# EAGLE design Sonar Amp (EAGLE 5.12)
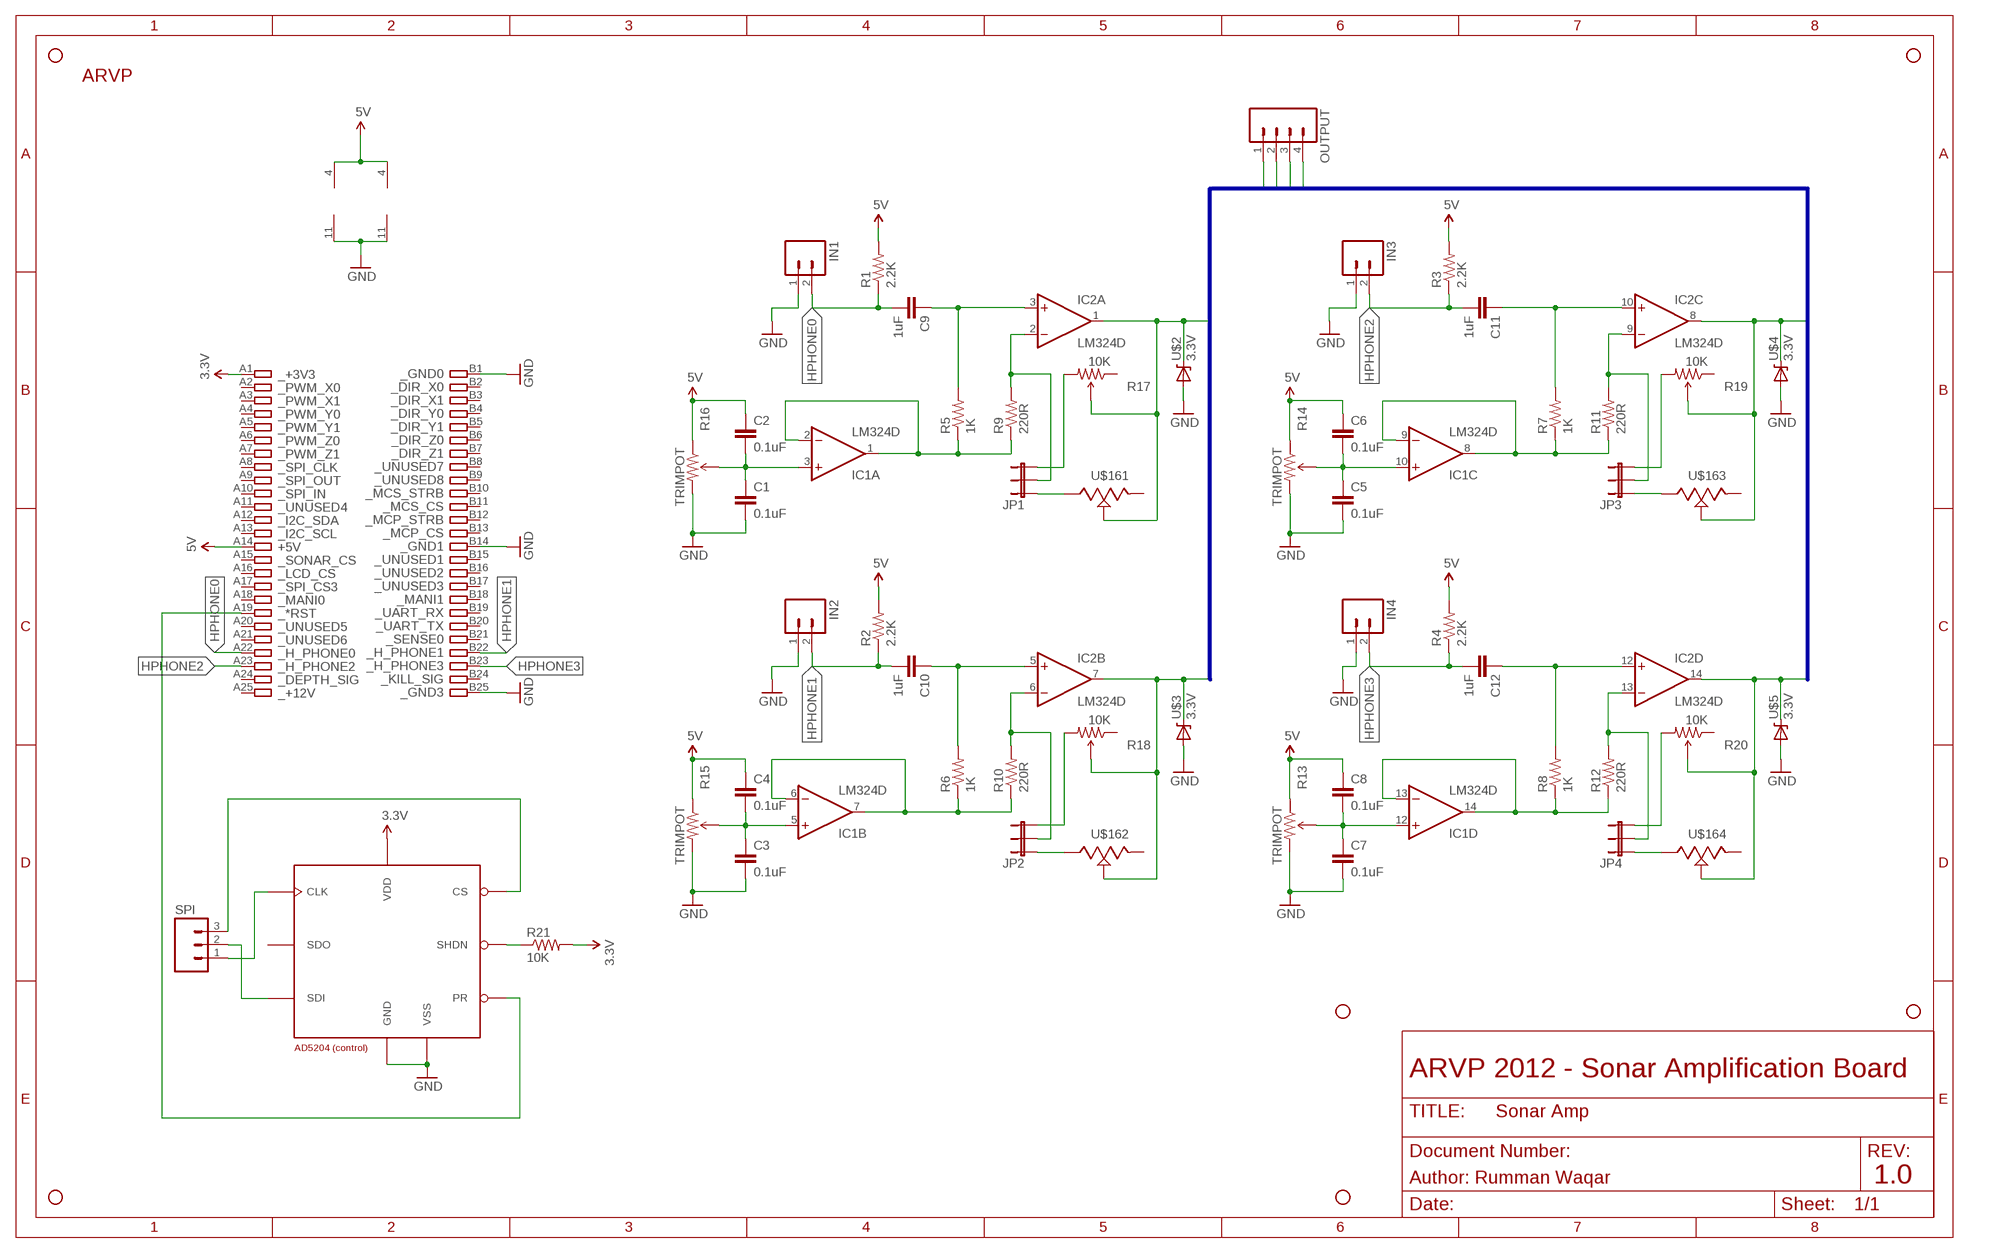
[diagram p0: schematic, sheet 1]

## Parts
C1  0.1uF  CAP1206  [1206]
C2  0.1uF  CAP1206  [1206]
C3  0.1uF  CAP1206  [1206]
C4  0.1uF  CAP1206  [1206]
C5  0.1uF  CAP1206  [1206]
C6  0.1uF  CAP1206  [1206]
C7  0.1uF  CAP1206  [1206]
C8  0.1uF  CAP1206  [1206]
C9  1uF  CAP1210  [1210]
C10  1uF  CAP1210  [1210]
C11  1uF  CAP1210  [1210]
C12  1uF  CAP1210  [1210]
IC1  LM324D  [SO14]
IC2  LM324D  [SO14]
IN1  M02POLAR_LOCK  [MOLEX-1X2_LOCK]
IN2  M02POLAR_LOCK  [MOLEX-1X2_LOCK]
IN3  M02POLAR_LOCK  [MOLEX-1X2_LOCK]
IN4  M02POLAR_LOCK  [MOLEX-1X2_LOCK]
JP1  JUMPER-3PTH  [1X03]
JP2  JUMPER-3PTH  [1X03]
JP3  JUMPER-3PTH  [1X03]
JP4  JUMPER-3PTH  [1X03]
JP5  STAND-OFF  [STAND-OFF]
JP6  STAND-OFF  [STAND-OFF]
JP7  STAND-OFF  [STAND-OFF]
JP8  STAND-OFF  [STAND-OFF]
JP9  STAND-OFF  [STAND-OFF]
JP10  STAND-OFF  [STAND-OFF]
OUTPUT  M04POLAR  [MOLEX-1X4]
R1  2.2K  RESISTOR1206  [1206]
R2  2.2K  RESISTOR1206  [1206]
R3  2.2K  RESISTOR1206  [1206]
R4  2.2K  RESISTOR1206  [1206]
R5  1K  RESISTOR1206  [1206]
R6  1K  RESISTOR1206  [1206]
R7  1K  RESISTOR1206  [1206]
R8  1K  RESISTOR1206  [1206]
R9  220R  RESISTOR1206  [1206]
R10  220R  RESISTOR1206  [1206]
R11  220R  RESISTOR1206  [1206]
R12  220R  RESISTOR1206  [1206]
R13  TRIMPOT  [3362U-2]
R14  TRIMPOT  [3362U-2]
R15  TRIMPOT  [3362U-2]
R16  TRIMPOT  [3362U-2]
R17  10K  TRIMPOT  [3362U-2]
R18  10K  TRIMPOT  [3362U-2]
R19  10K  TRIMPOT  [3362U-2]
R20  10K  TRIMPOT  [3362U-2]
R21  10K  RESISTOR1206  [1206]
SPI  M03POLAR  [MOLEX-1X3]
U$1  CARD_50PIN  [CARD_50PIN]
U$2  3.3V  DIODE-ZENERPTH  [DIODE-ZENER]
U$3  3.3V  DIODE-ZENERPTH  [DIODE-ZENER]
U$4  3.3V  DIODE-ZENERPTH  [DIODE-ZENER]
U$5  3.3V  DIODE-ZENERPTH  [DIODE-ZENER]
U$16  AD5204R  [SOL-24]
U$17  ARVP_LOGO  [ARVP]

## Nets
3.3V: R21.2 U$1.A1 U$16.VDD(CONTROL:VDD)
5V: C2.1 C4.1 C6.1 C8.1 IC1.4(P:V+) IC2.4(P:V+) R1.2 R2.2 R3.2 R4.2 R13.1(CCW) R14.1(CCW) R15.1(CCW) R16.1(CCW) U$1.A14
GND: C1.2 C3.2 C5.2 C7.2 IC1.11(P:V-) IC2.11(P:V-) IN1.1 IN2.1 IN3.1 IN4.1 R13.3(CW) R14.3(CW) R15.3(CW) R16.3(CW) U$1.B1 U$1.B14 U$1.B25 U$2.P$2(A) U$3.P$2(A) U$4.P$2(A) U$5.P$2(A) U$16.GND(CONTROL:GND) U$16.VSS(CONTROL:VSS)
HPHONE0: C9.2 IN1.2 R1.1 U$1.A22
HPHONE1: C10.2 IN2.2 R2.1 U$1.B22
HPHONE2: C11.2 IN3.2 R3.1 U$1.A23
HPHONE3: C12.2 IN4.2 R4.1 U$1.B23
N$1: C1.1 C2.2 IC1.3(A:+IN) R16.2(WIPER)
N$2: IC1.6(B:-IN) IC1.7(B:OUT) R6.1 R10.1
N$3: IC1.1(A:OUT) IC1.2(A:-IN) R5.1 R9.1
N$4: JP1.3 R17.3(CW)
N$5: C9.1 IC2.3(A:+IN) R5.2
N$6: IC2.2(A:-IN) JP1.2 R9.2
N$7: SPI.2 U$16.SDI(CONTROL:SDI)
N$8: JP1.1 U$16.A1(1:A)
N$9: C3.1 C4.2 IC1.5(B:+IN) R15.2(WIPER)
N$10: C10.1 IC2.5(B:+IN) R6.2
N$11: JP2.1 U$16.A2(2:A)
N$12: C5.1 C6.2 IC1.10(C:+IN) R14.2(WIPER)
N$13: IC2.6(B:-IN) JP2.2 R10.2
N$15: C7.1 C8.2 IC1.12(D:+IN) R13.2(WIPER)
N$16: JP2.3 R18.3(CW)
N$17: IC1.8(C:OUT) IC1.9(C:-IN) R7.1 R11.1
N$18: JP3.1 U$16.A3(3:A)
N$19: IC1.13(D:-IN) IC1.14(D:OUT) R8.1 R12.1
N$20: C11.1 IC2.10(C:+IN) R7.2
N$21: IC2.9(C:-IN) JP3.2 R11.2
N$23: JP3.3 R19.3(CW)
N$24: C12.1 IC2.12(D:+IN) R8.2
N$25: JP4.1 U$16.A4(4:A)
N$26: IC2.13(D:-IN) JP4.2 R12.2
N$28: JP4.3 R20.3(CW)
N$30: U$1.A19 U$16.PR(CONTROL:PR)
N$31: SPI.1 U$16.CLK(CONTROL:CLK)
N$32: SPI.3 U$16.CS(CONTROL:CS)
N$33: R21.1 U$16.SHDN(CONTROL:SHDN)
OUT1: IC2.1(A:OUT) OUTPUT.1 R17.2(WIPER) U$2.P$1(C) U$16.W1(1:W)
OUT2: IC2.7(B:OUT) OUTPUT.2 R18.2(WIPER) U$3.P$1(C) U$16.W2(2:W)
OUT3: IC2.8(C:OUT) OUTPUT.3 R19.2(WIPER) U$4.P$1(C) U$16.W3(3:W)
OUT4: IC2.14(D:OUT) OUTPUT.4 R20.2(WIPER) U$5.P$1(C) U$16.W4(4:W)
Unconnected: R17.1(CCW) R18.1(CCW) R19.1(CCW) R20.1(CCW) U$1.A2 U$1.A3 U$1.A4 U$1.A5 U$1.A6 U$1.A7 U$1.A8 U$1.A9 U$1.A10 U$1.A11 U$1.A12 U$1.A13 U$1.A15 U$1.A16 U$1.A17 U$1.A18 U$1.A20 U$1.A21 U$1.A24 U$1.A25 U$1.B2 U$1.B3 U$1.B4 U$1.B5 U$1.B6 U$1.B7 U$1.B8 U$1.B9 U$1.B10 U$1.B11 U$1.B12 U$1.B13 U$1.B15 U$1.B16 U$1.B17 U$1.B18 U$1.B19 U$1.B20 U$1.B21 U$1.B24 U$16.B1(1:B) U$16.B2(2:B) U$16.B3(3:B) U$16.B4(4:B) U$16.SDO(CONTROL:SDO)

## Buses
OUT1,OUT2,OUT3,OUT4

## Notes on the sheet
- ARVP 2012 - Sonar Amplification Board
- Author: Rumman Waqar | 1.0

## Library data of the parts
C1-C12 = SparkFun:CAP: Capacitor Standard 0603 ceramic capacitor, and 0.1" leaded capacitor.
IC1 IC2 = linear:LM324: OP AMP
IN1-IN4 = SparkFun:M02: Header 2 Standard 2-pin 0.1" header. Use with straight break away headers (SKU : PRT-00116), right angle break away headers (PRT-00553), swiss pins (PRT-00743), machine pins (PRT-00117), and female headers (PRT-00115). Molex polarized connector foot print use with SKU : PRT-08233 with associated crimp pins and housings.
JP1-JP4 = SparkFun:JUMPER-3
JP5-JP10 = SparkFun:STAND-OFF: Stand Off This is the mechanical footprint for a #4 phillips button head screw. Use the keepout ring to avoid running the screw head into surrounding components. SKU : PRT-00447
OUTPUT = SparkFun:M04: Header 4 Standard 4-pin 0.1" header. Use with straight break away headers (SKU : PRT-00116), right angle break away headers (PRT-00553), swiss pins (PRT-00743), machine pins (PRT-00117), and female headers (PRT-00115). Molex polarized connector foot print use with SKU : PRT-08231 with associated crimp pins and housings. 1MM SMD Version SKU: PRT-10208
R1-R12 R21 = SparkFun:RESISTOR: Resistor Basic schematic elements and footprints for 0603, 1206, and PTH resistors.
R13-R20 = SparkFun:TRIMPOT
SPI = SparkFun:M03: Header 3 Standard 3-pin 0.1" header. Use with straight break away headers (SKU : PRT-00116), right angle break away headers (PRT-00553), swiss pins (PRT-00743), machine pins (PRT-00117), and female headers (PRT-00115). Molex polarized connector foot print use with SKU : PRT-08232 with associated crimp pins and housings.
U$1 = ARVP:CARD_50PIN
U$2-U$5 = SparkFun:DIODE-ZENER: Zener Diode Production Part - 8199 3.4V Zener Voltage
U$16 = AD5204:AD5204: AD5204 - 4-Channel Digital Potentiometer
U$17 = ARVP:ARVP_LOGO

## Board
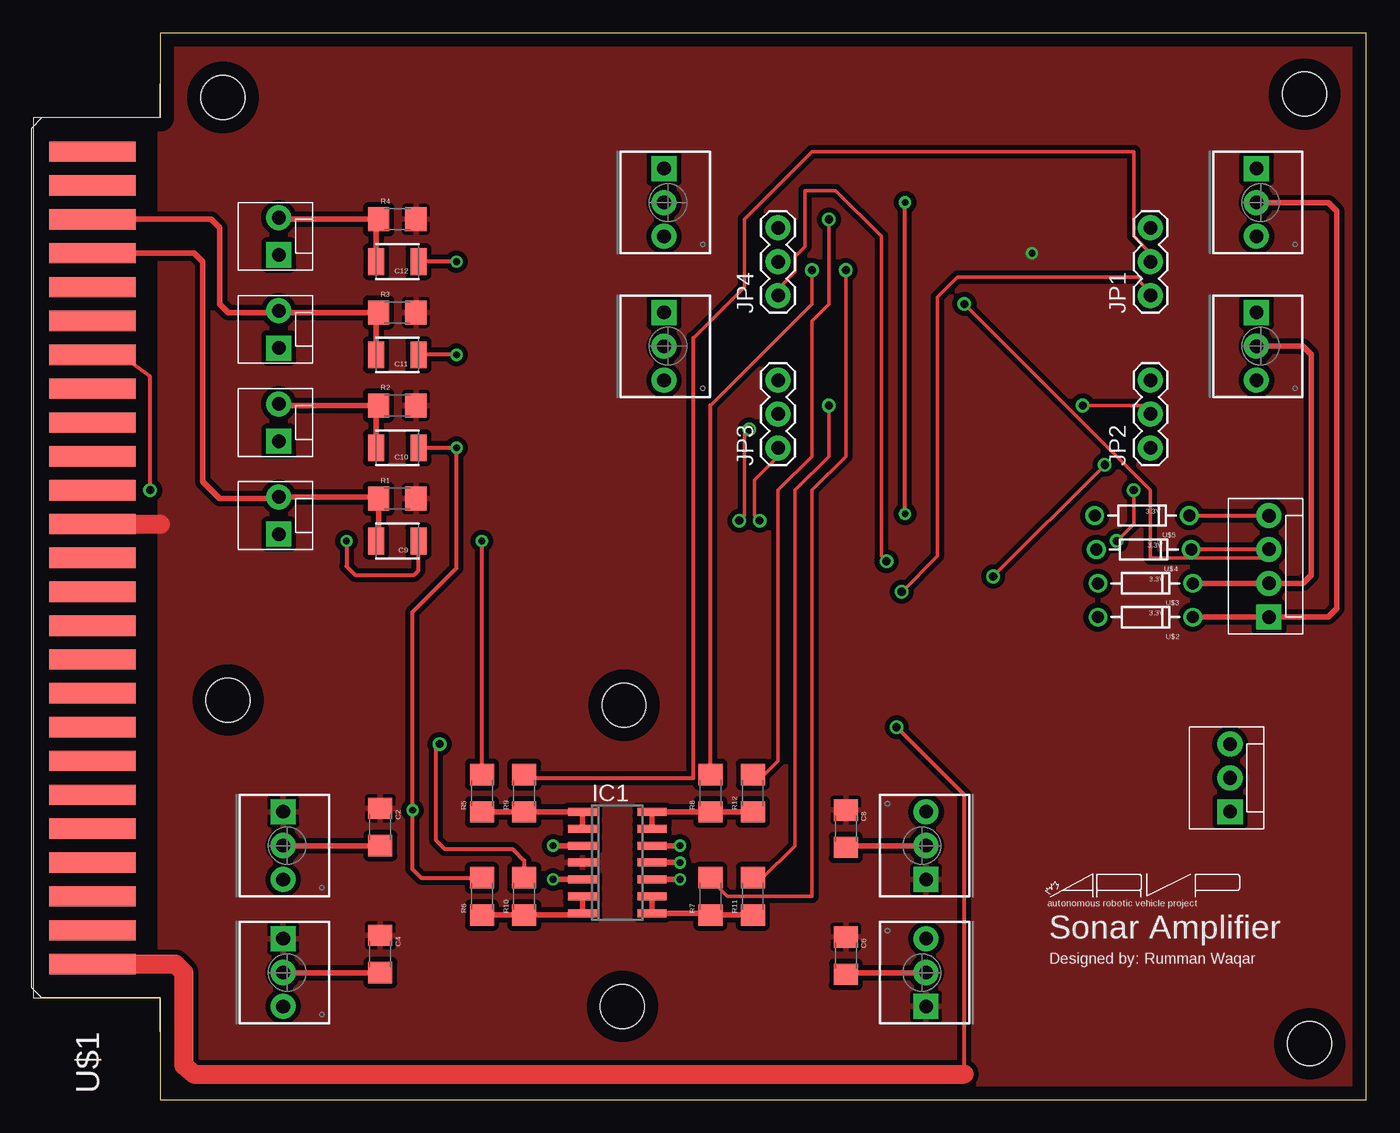
[diagram p1: board, top side]
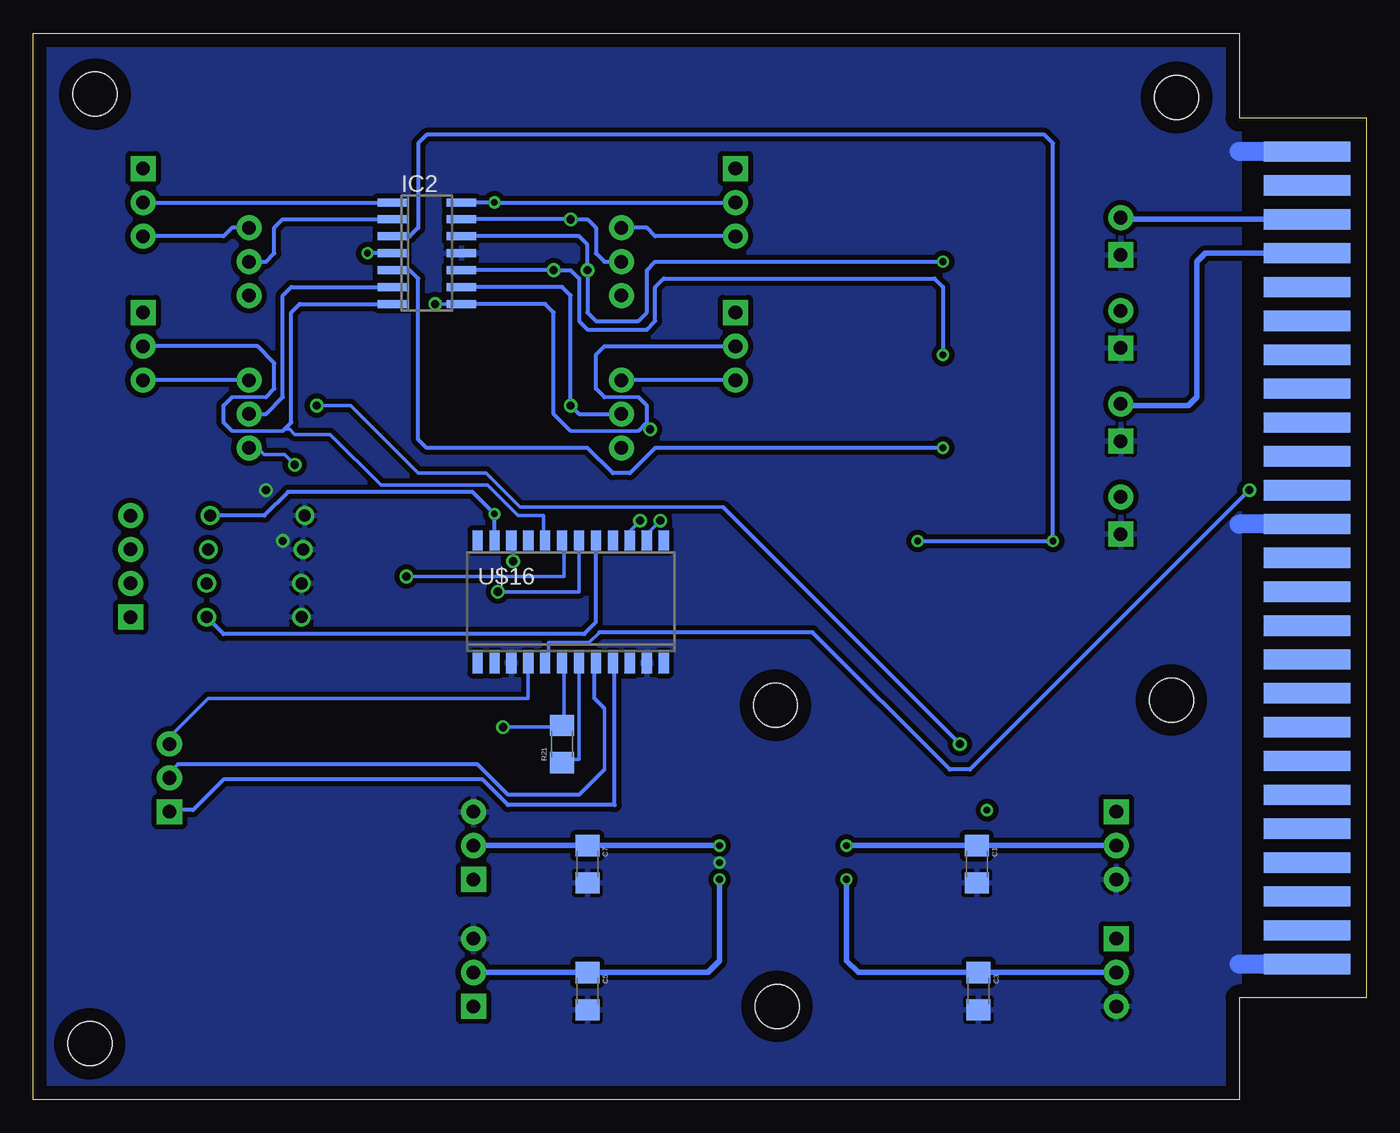
[diagram p2: board, bottom side, seen from below]

Size 100 x 80 mm. Coordinates in mm from the lower left corner, seen from the top.
Outline: 100,0 100,80 9.53,80 9.53,73.66 0,73.66 0,7.62 9.53,7.62 9.53,0 100,0
Copper layers (1*16): Top 0.035mm / dielectric 1.5mm / Bottom 0.035mm
Design rules "default": minimum track width 10mil, minimum drill 24mil, track to track 8mil, track to pad 8mil, pad to pad 8mil, via to via 8mil, smd to smd 8mil, copper to edge 40mil, drill to drill 8mil, minimum pad ring 10mil, minimum via ring 8mil, stop-mask expansion 4mil, vias tented up to drill 0mil, thermal gap 10mil

### Footprints (pad centres in the part's own frame; a part is rotated, then mirrored left to right if it is on the bottom)
1206 = smd 1.6 x 1.8: 1 -1.4,0; 2 1.4,0
1210 = smd 1.2 x 2: 1 -1.6,0; 2 1.6,0
SO14 = smd 0.6 x 2.2: 1 -3.81,-2.6; 2 -2.54,-2.6; 3 -1.27,-2.6; 4 0,-2.6; 5 1.27,-2.6; 6 2.54,-2.6; 7 3.81,-2.6; 8 3.81,2.6; 9 2.54,2.6; 10 1.27,2.6; 11 0,2.6; 12 -1.27,2.6; 13 -2.54,2.6; 14 -3.81,2.6
MOLEX-1X2_LOCK = drill 1.016 pad 1.88 square: 1 -0.127,0 | drill 1.016 pad 1.88 round: 2 2.667,0
1X03 = drill 1.016 pad 1.88 round: 1 0,0; 2 2.54,0; 3 5.08,0
STAND-OFF = hole 3.302: 0,0
MOLEX-1X4 = drill 1.016 pad 1.88 square: 1 0,0 | drill 1.016 pad 1.88 round: 2 2.54,0; 3 5.08,0; 4 7.62,0
3362U-2 = drill 1.016 pad 1.88 square: 1 -2.54,-0.305 | drill 1.016 pad 1.88 round: 2 0,-0.305; 3 2.54,-0.305
MOLEX-1X3 = drill 1.016 pad 1.88 square: 1 0,0 | drill 1.016 pad 1.88 round: 2 2.54,0; 3 5.08,0
CARD_50PIN = smd 1.524 x 6.477: A1 63.5,3.81; A2 60.96,3.81; A3 58.42,3.81; A4 55.88,3.81; A5 53.34,3.81; A6 50.8,3.81; A7 48.26,3.81; A8 45.72,3.81; A9 43.18,3.81; A10 40.64,3.81; A11 38.1,3.81; A12 35.56,3.81; A13 33.02,3.81; A14 30.48,3.81; A15 27.94,3.81; A16 25.4,3.81; A17 22.86,3.81; A18 20.32,3.81; A19 17.78,3.81; A20 15.24,3.81; A21 12.7,3.81; A22 10.16,3.81; A23 7.62,3.81; A24 5.08,3.81; A25 2.54,3.81 | smd 1.524 x 6.477 bottom: B1 63.5,3.81; B2 60.96,3.81; B3 58.42,3.81; B4 55.88,3.81; B5 53.34,3.81; B6 50.8,3.81; B7 48.26,3.81; B8 45.72,3.81; B9 43.18,3.81; B10 40.64,3.81; B11 38.1,3.81; B12 35.56,3.81; B13 33.02,3.81; B14 30.48,3.81; B15 27.94,3.81; B16 25.4,3.81; B17 22.86,3.81; B18 20.32,3.81; B19 17.78,3.81; B20 15.24,3.81; B21 12.7,3.81; B22 10.16,3.81; B23 7.62,3.81; B24 5.08,3.81; B25 2.54,3.81
DIODE-ZENER = drill 0.9 round: P$1 -3.556,0; P$2 3.556,0
SOL-24 = smd 0.762 x 1.524: A1 0.635,4.6; A2 -0.635,4.6; A3 4.445,4.6; A4 -4.445,4.6; B1 3.175,4.6; B2 -3.175,4.6; B3 6.985,4.6; B4 -6.985,4.6; CLK 3.175,-4.6; CS -3.175,-4.6; GND -4.445,-4.6; NC -6.985,-4.6; NC2 -5.715,-4.6; NC3 6.985,-4.6; PR -1.905,-4.6; SDI 1.905,-4.6; SDO 4.445,-4.6; SHDN 0.635,-4.6; VDD -0.635,-4.6; VSS 5.715,-4.6; W1 1.905,4.6; W2 -1.905,4.6; W3 5.715,4.6; W4 -5.715,4.6

### Placement (x,y rotation side)
C1  29.21,17.65 270 bottom
C2  26.04,20.45 270 top
C3  29.08,8.13 270 bottom
C4  26.04,10.92 270 top
C5  58.42,8.13 270 bottom
C6  60.96,10.79 270 top
C7  58.42,17.65 270 bottom
C8  60.96,20.32 270 top
C9  27.3,41.91 180 top
C10  27.3,48.9 180 top
C11  27.3,55.88 180 top
C12  27.3,62.87 180 top
IC1  43.81,17.78 270 top
IC2  70.48,63.5 270 bottom
IN1  18.41,42.55 90 top
IN2  18.41,49.53 90 top
IN3  18.41,56.52 90 top
IN4  18.41,63.5 90 top
JP1  83.82,60.33 90 top
JP2  83.82,48.9 90 top
JP3  55.88,48.9 90 top
JP4  55.88,60.33 90 top
JP5  95.76,4.19 0 top
JP6  95.38,75.44 0 top
JP7  44.2,6.99 0 top
JP8  14.61,29.97 0 top
JP9  14.22,75.18 0 top
JP10  44.32,29.59 0 top
OUTPUT  92.71,36.2 90 top
R1  27.3,45.09 0 top
R2  27.3,52.07 0 top
R3  27.3,59.05 0 top
R4  27.3,66.04 0 top
R5  33.66,22.99 90 top
R6  33.66,15.24 90 top
R7  50.8,15.24 90 top
R8  50.8,22.99 90 top
R9  36.83,22.99 90 top
R10  36.83,15.24 90 top
R11  53.98,15.24 90 top
R12  53.98,22.99 90 top
R13  66.67,19.05 90 top
R14  66.67,9.53 90 top
R15  19.05,9.53 270 top
R16  19.05,19.05 270 top
R17  92.08,67.31 270 top
R18  92.08,56.52 270 top
R19  47.62,56.52 270 top
R20  47.62,67.31 270 top
R21  60.33,26.67 90 bottom
SPI  89.79,21.59 90 top
U$1  0.64,73.66 270 top
U$2  83.44,36.2 180 top
U$3  83.44,38.73 180 top
U$4  83.31,41.27 180 top
U$5  83.19,43.81 180 top
U$16  59.69,37.34 0 bottom
U$17  76.07,14.48 0 top

### Tracks (layer width: path | path; a pad name or v marks a point on that pad's centre or on a via)
3.3V  (via drill 0.61)
  Top 0.305: v64.77,27.94 69.85,22.86 69.85,1.91
  Top 1.422: U$1.A1 10.67,10.16 11.3,9.53 11.3,2.54 12.06,1.91 69.85,1.91
  Bottom 0.254: v64.77,27.94 60.96,27.94 R21.2 60.2,28.19 60.2,32.38 U$16.VDD
5V  (via drill 0.51)
  Top 1.422: U$1.A14 9.53,43.18
  Bottom 0.305: IC2.4 v74.93,63.5
  pour Top (isolate 0.381): 9.53,80.01 100.33,80.01 100.33,0 9.53,0
GND  (via drill 0.51, 0.61)
  Top 0.254: v81.28,41.91 82.55,43.18 v82.55,45.72
  Top 0.406: IC1.11 v48.51,17.78
  Bottom 1.422: U$1.B1 9.53,10.16 | U$1.B14 9.53,43.18 | U$1.B25 9.53,71.12
  pour Bottom (isolate 0.381): 9.53,80.01 100.33,80.01 100.33,0 9.53,0
HPHONE0
  Top 0.406: U$1.A22 12.06,63.5 12.7,62.87 12.7,46.35 13.97,45.09 18.29,45.09 IN1.2 25.78,45.21 R1.1 25.91,42.11 C9.2
HPHONE1
  Top 0.406: C10.2 25.7,51.87 R2.1 18.54,52.07 IN2.2
  Bottom 0.406: U$1.B22 12.06,63.5 12.7,62.87 12.7,52.7 13.34,52.07 18.29,52.07 IN2.2
HPHONE2
  Top 0.406: U$1.A23 13.34,66.04 13.97,65.41 13.97,59.69 14.61,59.05 18.29,59.05 IN3.2 18.54,59.05 R3.1 25.7,58.85 C11.2
HPHONE3
  Top 0.406: C12.2 25.7,65.84 R4.1 18.54,66.04 IN4.2
  Bottom 0.406: U$1.B23 18.29,66.04 IN4.2
N$1  (via drill 0.51)
  Top 0.406: C2.2 R16.2 | IC1.3 v38.99,19.05
  Bottom 0.406: R16.2 19,19.05 C1.1 v38.99,19.05
N$2
  Top 0.406: R6.1 R10.1 41.09,13.84 IC1.7 IC1.6
N$3
  Top 0.406: IC1.2 IC1.1 R9.1 R5.1
N$4
  Bottom 0.305: JP1.3 85.09,65.41 85.72,64.77 R17.3
N$5  (via drill 0.51)
  Top 0.305: C9.1 28.91,39.7 28.57,39.37 24.13,39.37 23.5,40.01 v23.5,41.91 | R5.2 v33.66,41.91
  Bottom 0.305: IC2.3 71.75,64.77 71.12,65.41 71.12,71.75 70.48,72.39 24.13,72.39 23.5,71.75 v23.5,41.91 v33.66,41.91
N$6
  Top 0.254: 49.53,57.15 53.34,60.96 53.34,66.04 58.42,71.12 82.55,71.12 82.55,64.77 83.82,63.5 JP1.2 | R9.2 36.83,24.13
  Top 0.305: 36.83,24.13 49.53,24.13 49.53,57.15
  Bottom 0.305: IC2.2 81.28,66.04 81.92,65.41 81.92,63.5 82.55,62.87 JP1.2
N$7
  Bottom 0.254: 57.15,24.77 57.15,29.34 | 89.15,25.15 89.92,24.38 SPI.2 | 57.91,32.38 U$16.SDI
  Bottom 0.305: 57.91,32.38 57.91,30.1 57.15,29.34 | 57.15,24.77 59.05,22.86 64.39,22.86 66.67,25.15 89.15,25.15
N$8  (via drill 0.61)
  Top 0.254: v65.15,38.1 67.82,40.77 67.82,60.2 69.34,61.72 83.06,61.72 83.06,61.34 83.82,60.58 JP1.1
  Bottom 0.254: v65.15,38.1 59.05,38.1 U$16.A1
N$9  (via drill 0.51)
  Top 0.406: C4.2 R15.2 | v38.99,16.51 IC1.5
  Bottom 0.406: R15.2 18.88,9.53 C3.1 38.1,9.53 38.99,10.41 v38.99,16.51
N$10  (via drill 0.51)
  Top 0.305: C10.1 v31.75,48.9 31.75,39.88 28.45,36.58 v28.45,21.72 28.45,17.27 29.08,16.64 R6.2
  Bottom 0.305: IC2.5 71.75,62.23 71.12,61.59 71.12,49.53 70.48,48.9 58.42,48.9 56.52,46.99 55.24,46.99 53.34,48.9 v31.75,48.9
N$11  (via drill 0.61)
  Top 0.254: v72.01,39.24 v80.39,47.62
  Bottom 0.254: v72.01,39.24 60.2,39.24 60.2,41.91 U$16.A2 | v80.39,47.62 81.15,48.39 82.68,48.39 83.06,48.77 83.82,48.77 JP2.1
N$12  (via drill 0.51)
  Top 0.406: R14.2 61.09,9.53 C6.2 | v48.51,16.51 IC1.10
  Bottom 0.406: R14.2 C5.1 49.4,9.53 48.51,10.41 v48.51,16.51
N$13  (via drill 0.61)
  Top 0.254: v78.74,52.07 83.82,52.07 JP2.2 | 30.35,26.67 v30.48,26.67
  Top 0.305: R10.2 36.83,17.91 35.94,18.8 30.86,18.8 30.23,19.43 30.23,26.54 30.35,26.67
  Bottom 0.254: 48.26,44.45 63.5,44.45 66.04,46.99 71.12,46.99 76.2,52.07 v78.74,52.07
  Bottom 0.305: JP2.2 82.55,51.44 81.28,52.7 81.28,60.33 80.64,60.96 IC2.6 | v30.48,26.67 48.26,44.45
N$15  (via drill 0.51)
  Top 0.406: R13.2 61.09,19.05 C8.2 | IC1.12 v48.51,19.05
  Bottom 0.406: R13.2 C7.1 v48.52,19.05 v48.51,19.05
N$16
  Bottom 0.305: JP2.3 R18.3
N$17
  Top 0.406: IC1.9 IC1.8 50.03,13.97 R7.1 50.17,13.84 52.58,13.84 R11.1
N$18  (via drill 0.61)
  Top 0.254: v54.48,43.43 54.1,43.81 54.1,46.48 55.63,48.01 55.63,48.77 JP3.1
  Bottom 0.254: v54.48,43.43 55.24,42.67 U$16.A3
N$19
  Top 0.406: IC1.13 IC1.14 R8.1 R12.1
N$20  (via drill 0.51, 0.61)
  Top 0.254: v60.96,62.23 60.96,48.26 58.42,45.72 58.42,15.24 52.07,15.24 50.8,16.51 R7.2
  Top 0.305: v31.75,55.88 C11.1
  Bottom 0.305: IC2.10 v60.96,62.23 59.69,62.23 59.05,61.59 59.05,58.42 58.42,57.78 53.98,57.78 53.34,58.42 53.34,60.96 52.7,61.59 32.38,61.59 31.75,60.96 v31.75,55.88
N$21  (via drill 0.61)
  Top 0.254: v59.69,52.07 59.69,48.26 57.15,45.72 57.15,19.05 54.61,16.51 R11.2
  Bottom 0.305: IC2.9 60.33,60.96 59.69,60.33 v59.69,52.07 59.05,51.44 JP3.2
N$23
  Bottom 0.305: R19.3 JP3.3
N$24  (via drill 0.51, 0.61)
  Top 0.254: 50.8,52.07 58.42,59.69 v58.42,62.23 | R8.2 50.8,24.13
  Top 0.305: v31.75,62.87 C12.1 | R8.2 50.8,52.07
  Bottom 0.305: IC2.12 59.05,64.77 58.42,64.14 v58.42,62.23 58.42,59.05 57.78,58.42 54.61,58.42 53.98,59.05 53.98,62.23 53.34,62.87 v31.75,62.87
N$25  (via drill 0.61)
  Top 0.254: v64.01,40.39 63.63,40.77 63.63,64.77 60.2,68.2 57.91,68.2 57.91,64.01 57.15,63.25 57.15,62.1 56.01,60.96 56.01,60.58 JP4.1
  Bottom 0.254: v64.01,40.39 64.01,41.91 U$16.A4
N$26  (via drill 0.61)
  Top 0.254: v59.69,66.04 59.69,59.69 58.42,58.42 58.42,48.26 55.88,45.72 55.88,25.4 54.61,24.13 R12.2
  Bottom 0.305: JP4.2 57.15,62.87 57.78,63.5 57.78,65.41 58.42,66.04 v59.69,66.04 IC2.13
N$28
  Bottom 0.305: R20.3 53.34,64.77 53.98,65.41 JP4.3
N$30  (via drill 0.61)
  Top 0.254: 6.86,55.63 4.57,55.63 U$1.A19
  Top 0.305: v8.76,45.72 8.76,54.23 6.86,55.63
  Bottom 0.254: 57.53,35.05 58.29,34.29 61.34,34.29 61.34,32.77 U$16.PR
  Bottom 0.305: 57.53,35.05 41.53,35.05 31.24,24.77 29.72,24.77 v8.76,45.72
N$31
  Bottom 0.254: 56.39,32.38 U$16.CLK | 89.53,21.72 SPI.1
  Bottom 0.305: 56.39,32.38 56.39,22.1 64.39,22.1 66.29,24 85.72,24 88.01,21.72 89.53,21.72
N$32
  Bottom 0.254: U$16.CS 62.87,30.1 86.87,30.1 89.53,27.43 89.53,26.67 SPI.3
N$33
  Bottom 0.254: U$16.SHDN 59.05,25.53 60.2,25.53 R21.1
OUT1
  Top 0.406: U$2.P$1 OUTPUT.1 97.16,36.2 97.79,36.83 97.79,66.67 97.16,67.31 R17.2
  Bottom 0.305: R17.2 IC2.1 | U$16.W1 57.78,35.81 58.67,34.92 85.72,34.92 U$2.P$1
OUT2
  Top 0.406: U$3.P$1 OUTPUT.2 95.25,38.73 95.89,39.37 95.89,55.88 95.25,56.52 R18.2
  Bottom 0.254: 85.09,52.7 82.55,52.7 | 81.28,50.16 85.09,50.16 | 81.15,50.29 80.77,50.29 80.39,49.91 77.72,49.91 73.91,46.1 65.91,46.1 63.63,43.81 61.72,43.81 61.72,42.29 U$16.W2
  Bottom 0.305: R18.2 83.19,56.52 81.92,55.24 81.92,53.34 82.55,52.7 | 85.09,52.7 85.72,52.07 85.72,50.8 85.09,50.16 | IC2.7 80.01,59.69 80.64,59.05 80.64,50.8 81.15,50.29 81.28,50.16
OUT3  (via drill 0.61)
  Top 0.254: v69.85,59.69 83.82,45.72 83.82,40.64 92.71,40.64 OUTPUT.3 | v52.96,43.43 53.34,43.81 53.34,49.91 v53.72,50.29
  Top 0.305: OUTPUT.3 U$4.P$1
  Bottom 0.254: 54.61,52.7 57.15,52.7 | 54.61,50.16 59.69,50.16 | IC2.8 v69.85,59.69 | v52.96,43.43 53.72,42.67 53.72,42.29 U$16.W3 | v53.72,50.29 54.1,50.67
  Bottom 0.305: R19.2 57.15,56.52 57.78,55.88 57.78,53.34 57.15,52.7 | 54.61,52.7 53.98,52.07 53.98,50.8 54.1,50.67 54.61,50.16 | 59.69,50.16 60.96,51.44 60.96,59.05 61.59,59.69 IC2.8
OUT4  (via drill 0.51)
  Top 0.305: U$5.P$1 OUTPUT.4 | v65.41,43.94 v65.41,67.31
  Bottom 0.305: R20.2 v65.41,67.31 IC2.14 | U$16.W4 v65.41,43.94 67.06,45.59 80.9,45.59 82.68,43.81 U$5.P$1

### Text on the board
tNames: Sonar Amplifier | Designed by: Rumman Waqar